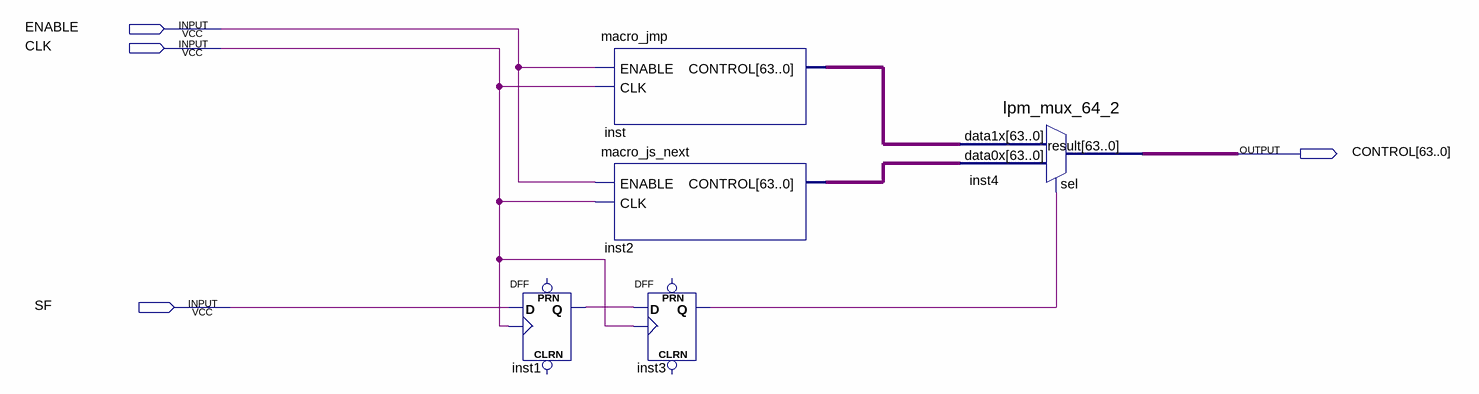
[diagram p0: schematic sheet]
// Quartus schematic macro_jms.bdf as structural Verilog: 5 symbols, 4 pins
module macro_jms (
  input  ENABLE,
  input  CLK,
  input  SF,
  output [63:0] CONTROL
);

  wire inst1_q, inst3_q;
  wire [63:0] inst2_control, inst_control;

  DFF inst1 (.CLK(CLK), .D(SF), .Q(inst1_q));  // open: CLRN, PRN
  macro_jmp inst (.ENABLE(ENABLE), .CLK(CLK), .CONTROL(inst_control));
  macro_js_next inst2 (.ENABLE(ENABLE), .CLK(CLK), .CONTROL(inst2_control));
  DFF inst3 (.CLK(CLK), .D(inst1_q), .Q(inst3_q));  // open: CLRN, PRN
  lpm_mux_64_2 inst4 (.data1x(inst_control), .data0x(inst2_control), .sel(inst3_q), .result(CONTROL));
endmodule
